# Altium schematic sheet S7CAS-PLEIADES-CARTE-MERE_P20_FPGA-Bank-0.SchDoc
size Tabloid; SheetNumber: 9; SheetTotal: 20; Sheet_Name: FPGA Bank 0; Size: 11x17
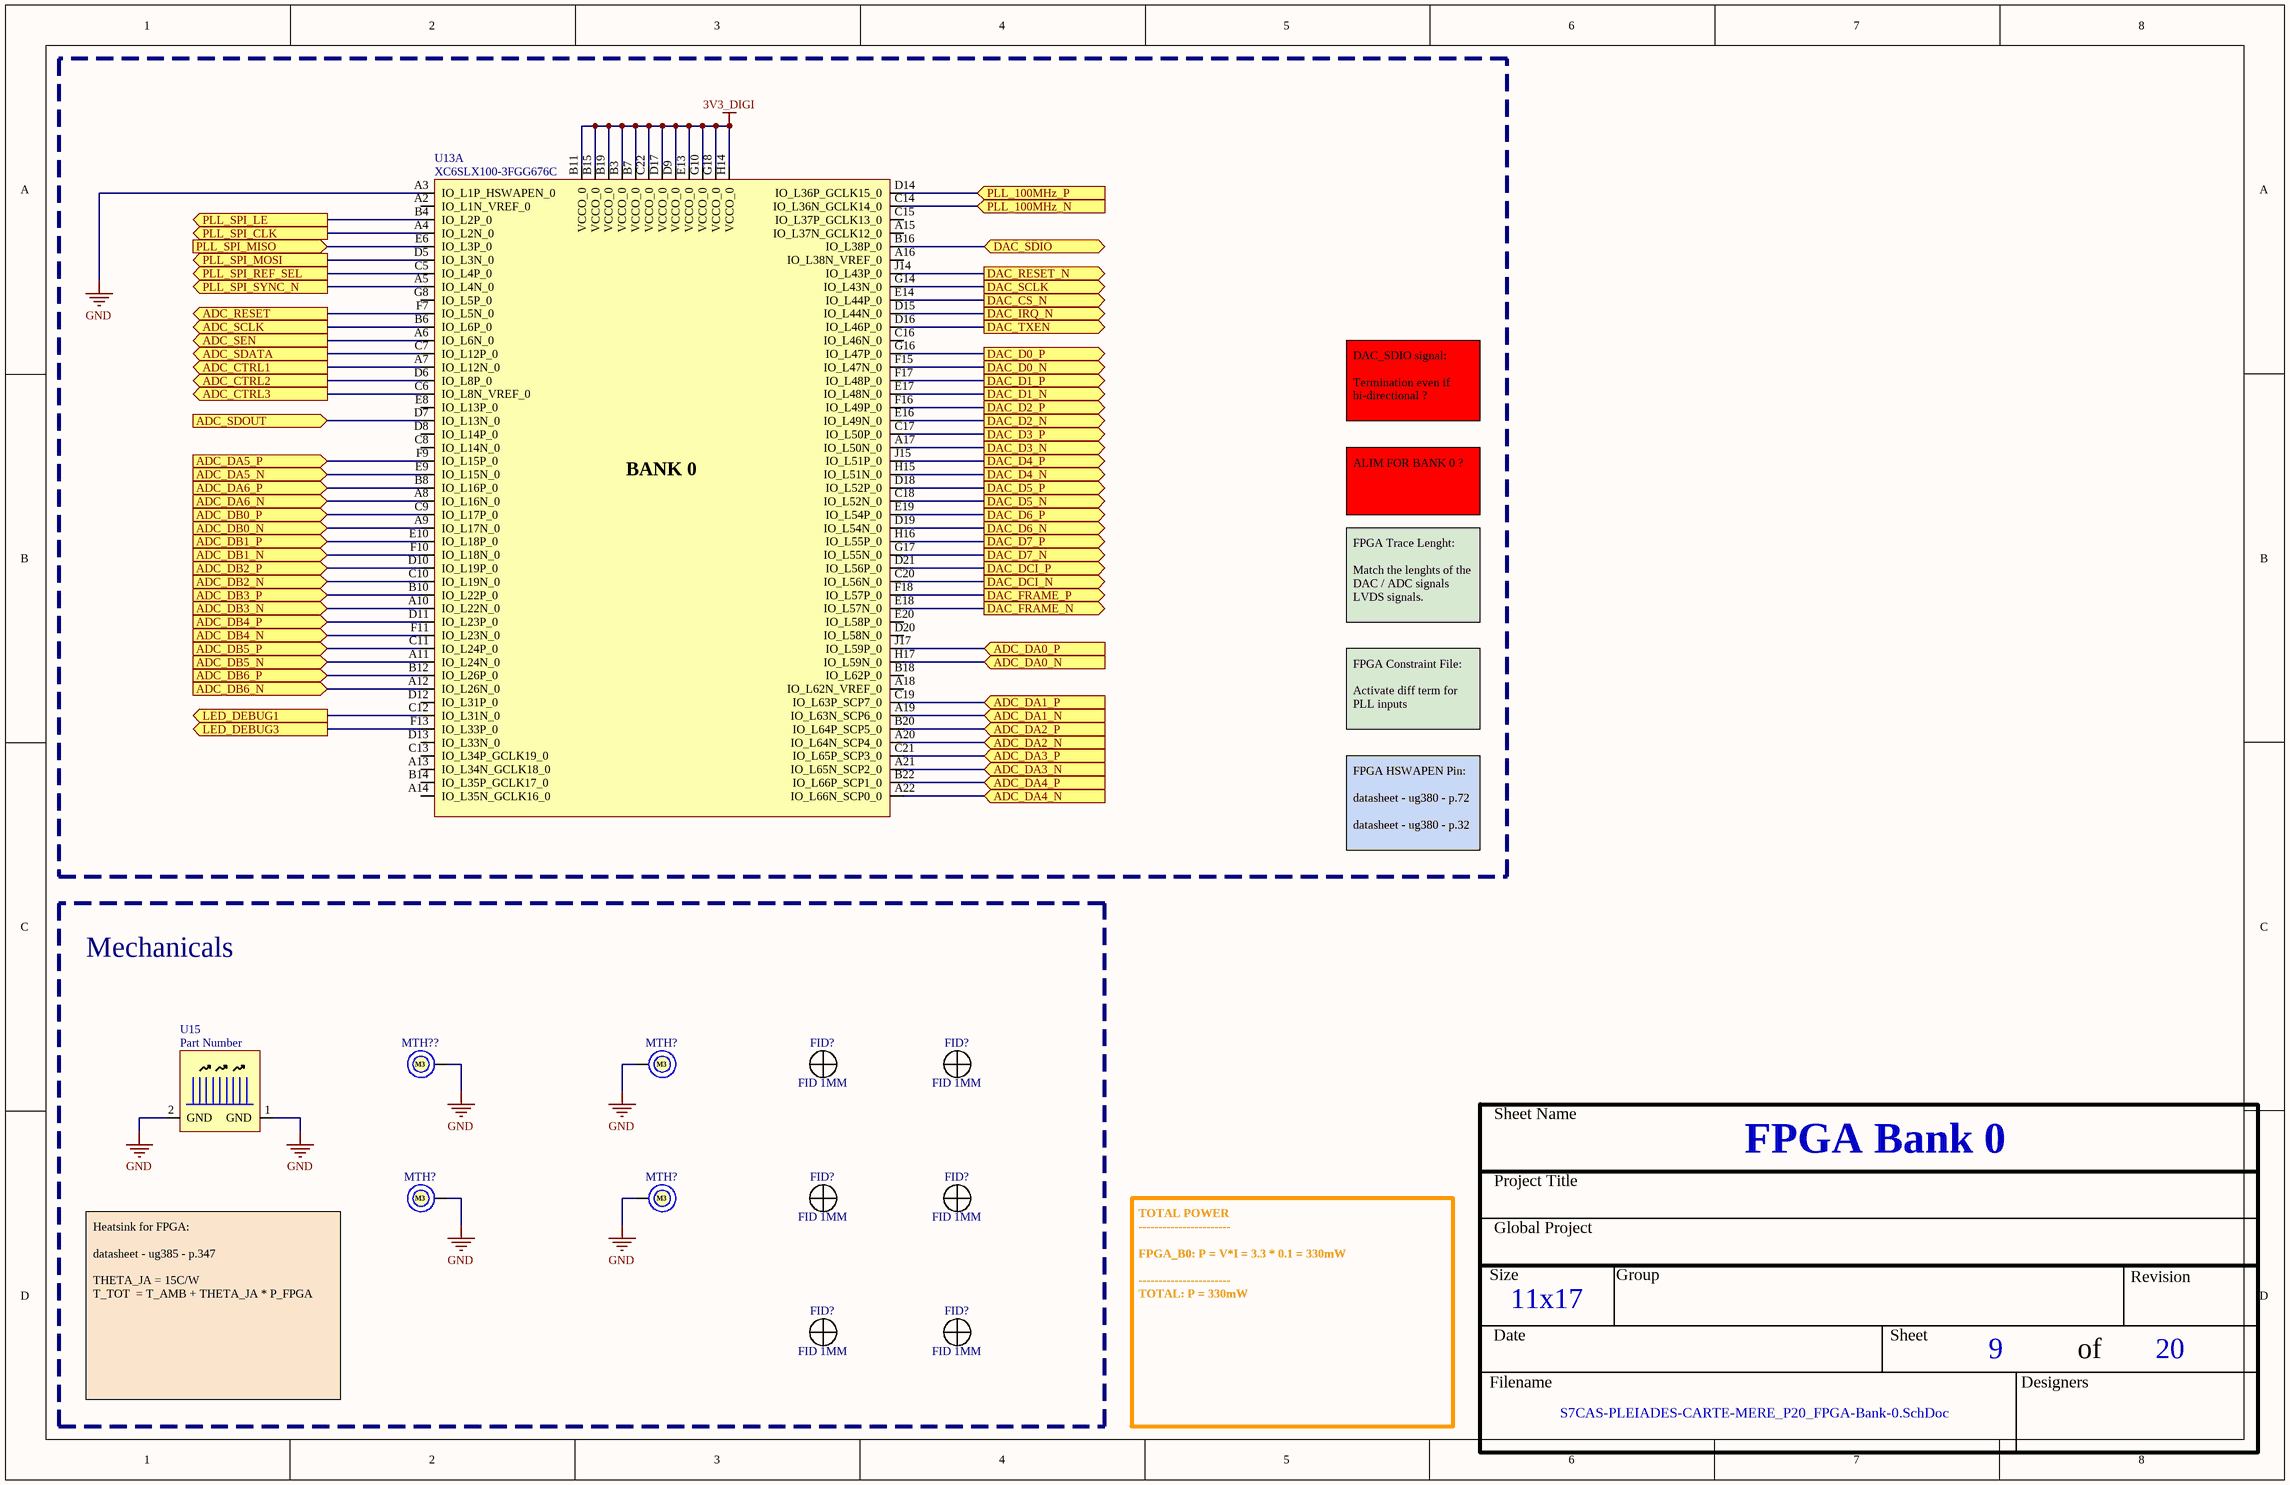
[diagram p0: S7CAS-PLEIADES-CARTE-MERE_P20_FPGA-Bank-0.SchDoc]

## Parts
(Parts that share a designator on the sheet are numbered #1, #2 ... from top to bottom, then left to right.)
FID?#1  FID 1MM  [FID_CIRCLE_1MM]
FID?#2  FID 1MM  [FID_CIRCLE_1MM]
FID?#3  FID 1MM  [FID_CIRCLE_1MM]
FID?#4  FID 1MM  [FID_CIRCLE_1MM]
FID?#5  FID 1MM  [FID_CIRCLE_1MM]
FID?#6  FID 1MM  [FID_CIRCLE_1MM]
MTH?#1  M3  [MTH_M3]  (no BOM)
MTH?#2  M3  [MTH_M3]  (no BOM)
MTH?#3  M3  [MTH_M3]  (no BOM)
MTH??  M3  [MTH_M3]  (no BOM)
U13  XC6SLX100-3FGG676C  [FPGA_XILINX_FGG676]  (part A of 10)
U15  Part Number

## Blocks framed on the sheet
Mechanicals: FID?#1-FID?#6 MTH?#1-MTH?#3 MTH?? U15

## Ports
ADC_CTRL1 (out), ADC_CTRL2 (out), ADC_CTRL3 (out), ADC_DA0_N (in), ADC_DA0_P (in), ADC_DA1_N (in), ADC_DA1_P (in), ADC_DA2_N (in), ADC_DA2_P (in), ADC_DA3_N (in), ADC_DA3_P (in), ADC_DA4_N (in), ADC_DA4_P (in), ADC_DA5_N (in), ADC_DA5_P (in), ADC_DA6_N (in), ADC_DA6_P (in), ADC_DB0_N (in), ADC_DB0_P (in), ADC_DB1_N (in), ADC_DB1_P (in), ADC_DB2_N (in), ADC_DB2_P (in), ADC_DB3_N (in), ADC_DB3_P (in), ADC_DB4_N (in), ADC_DB4_P (in), ADC_DB5_N (in), ADC_DB5_P (in), ADC_DB6_N (in), ADC_DB6_P (in), ADC_RESET (out), ADC_SCLK (out), ADC_SDATA (out), ADC_SDOUT (in), ADC_SEN (out), DAC_CS_N (out), DAC_D0_N (out), DAC_D0_P (out), DAC_D1_N (out), DAC_D1_P (out), DAC_D2_N (out), DAC_D2_P (out), DAC_D3_N (out), DAC_D3_P (out), DAC_D4_N (out), DAC_D4_P (out), DAC_D5_N (out), DAC_D5_P (out), DAC_D6_N (out), DAC_D6_P (out), DAC_D7_N (out), DAC_D7_P (out), DAC_DCI_N (out), DAC_DCI_P (out), DAC_FRAME_N (out), DAC_FRAME_P (out), DAC_IRQ_N (out), DAC_RESET_N (out), DAC_SCLK (out), DAC_SDIO (bidir), DAC_TXEN (out), LED_DEBUG1 (out), LED_DEBUG3 (out), PLL_100MHz_N (in), PLL_100MHz_P (in), PLL_SPI_CLK (out), PLL_SPI_LE (out), PLL_SPI_MISO (in), PLL_SPI_MOSI (out), PLL_SPI_REF_SEL (out), PLL_SPI_SYNC_N (out)

## Nets
3V3_DIGI: U13.B3(VCCO_0) U13.B7(VCCO_0) U13.B11(VCCO_0) U13.B15(VCCO_0) U13.B19(VCCO_0) U13.C22(VCCO_0) U13.D9(VCCO_0) U13.D17(VCCO_0) U13.E13(VCCO_0) U13.G10(VCCO_0) U13.G18(VCCO_0) U13.H14(VCCO_0)
GND: MTH?#1.1 MTH?#2.1 MTH?#3.1 MTH??.1 U13.A3(IO_L1P_HSWAPEN_0) U15.1(GND) U15.2(GND)
ADC_CTRL1: U13.A7(IO_L12N_0) ; port ADC_CTRL1
ADC_CTRL2: U13.D6(IO_L8P_0) ; port ADC_CTRL2
ADC_CTRL3: U13.C6(IO_L8N_VREF_0) ; port ADC_CTRL3
ADC_DA0_N: U13.H17(IO_L59N_0) ; port ADC_DA0_N
ADC_DA0_P: U13.J17(IO_L59P_0) ; port ADC_DA0_P
ADC_DA1_N: U13.A19(IO_L63N_SCP6_0) ; port ADC_DA1_N
ADC_DA1_P: U13.C19(IO_L63P_SCP7_0) ; port ADC_DA1_P
ADC_DA2_N: U13.A20(IO_L64N_SCP4_0) ; port ADC_DA2_N
ADC_DA2_P: U13.B20(IO_L64P_SCP5_0) ; port ADC_DA2_P
ADC_DA3_N: U13.A21(IO_L65N_SCP2_0) ; port ADC_DA3_N
ADC_DA3_P: U13.C21(IO_L65P_SCP3_0) ; port ADC_DA3_P
ADC_DA4_N: U13.A22(IO_L66N_SCP0_0) ; port ADC_DA4_N
ADC_DA4_P: U13.B22(IO_L66P_SCP1_0) ; port ADC_DA4_P
ADC_DA5_N: U13.E9(IO_L15N_0) ; port ADC_DA5_N
ADC_DA5_P: U13.F9(IO_L15P_0) ; port ADC_DA5_P
ADC_DA6_N: U13.A8(IO_L16N_0) ; port ADC_DA6_N
ADC_DA6_P: U13.B8(IO_L16P_0) ; port ADC_DA6_P
ADC_DB0_N: U13.A9(IO_L17N_0) ; port ADC_DB0_N
ADC_DB0_P: U13.C9(IO_L17P_0) ; port ADC_DB0_P
ADC_DB1_N: U13.F10(IO_L18N_0) ; port ADC_DB1_N
ADC_DB1_P: U13.E10(IO_L18P_0) ; port ADC_DB1_P
ADC_DB2_N: U13.C10(IO_L19N_0) ; port ADC_DB2_N
ADC_DB2_P: U13.D10(IO_L19P_0) ; port ADC_DB2_P
ADC_DB3_N: U13.A10(IO_L22N_0) ; port ADC_DB3_N
ADC_DB3_P: U13.B10(IO_L22P_0) ; port ADC_DB3_P
ADC_DB4_N: U13.F11(IO_L23N_0) ; port ADC_DB4_N
ADC_DB4_P: U13.D11(IO_L23P_0) ; port ADC_DB4_P
ADC_DB5_N: U13.A11(IO_L24N_0) ; port ADC_DB5_N
ADC_DB5_P: U13.C11(IO_L24P_0) ; port ADC_DB5_P
ADC_DB6_N: U13.A12(IO_L26N_0) ; port ADC_DB6_N
ADC_DB6_P: U13.B12(IO_L26P_0) ; port ADC_DB6_P
ADC_RESET: U13.F7(IO_L5N_0) ; port ADC_RESET
ADC_SCLK: U13.B6(IO_L6P_0) ; port ADC_SCLK
ADC_SDATA: U13.C7(IO_L12P_0) ; port ADC_SDATA
ADC_SDOUT: U13.D7(IO_L13N_0) ; port ADC_SDOUT
ADC_SEN: U13.A6(IO_L6N_0) ; port ADC_SEN
DAC_CS_N: U13.E14(IO_L44P_0) ; port DAC_CS_N
DAC_D0_N: U13.F15(IO_L47N_0) ; port DAC_D0_N
DAC_D0_P: U13.G16(IO_L47P_0) ; port DAC_D0_P
DAC_D1_N: U13.E17(IO_L48N_0) ; port DAC_D1_N
DAC_D1_P: U13.F17(IO_L48P_0) ; port DAC_D1_P
DAC_D2_N: U13.E16(IO_L49N_0) ; port DAC_D2_N
DAC_D2_P: U13.F16(IO_L49P_0) ; port DAC_D2_P
DAC_D3_N: U13.A17(IO_L50N_0) ; port DAC_D3_N
DAC_D3_P: U13.C17(IO_L50P_0) ; port DAC_D3_P
DAC_D4_N: U13.H15(IO_L51N_0) ; port DAC_D4_N
DAC_D4_P: U13.J15(IO_L51P_0) ; port DAC_D4_P
DAC_D5_N: U13.C18(IO_L52N_0) ; port DAC_D5_N
DAC_D5_P: U13.D18(IO_L52P_0) ; port DAC_D5_P
DAC_D6_N: U13.D19(IO_L54N_0) ; port DAC_D6_N
DAC_D6_P: U13.E19(IO_L54P_0) ; port DAC_D6_P
DAC_D7_N: U13.G17(IO_L55N_0) ; port DAC_D7_N
DAC_D7_P: U13.H16(IO_L55P_0) ; port DAC_D7_P
DAC_DCI_N: U13.C20(IO_L56N_0) ; port DAC_DCI_N
DAC_DCI_P: U13.D21(IO_L56P_0) ; port DAC_DCI_P
DAC_FRAME_N: U13.E18(IO_L57N_0) ; port DAC_FRAME_N
DAC_FRAME_P: U13.F18(IO_L57P_0) ; port DAC_FRAME_P
DAC_IRQ_N: U13.D15(IO_L44N_0) ; port DAC_IRQ_N
DAC_RESET_N: U13.J14(IO_L43P_0) ; port DAC_RESET_N
DAC_SCLK: U13.G14(IO_L43N_0) ; port DAC_SCLK
DAC_SDIO: U13.B16(IO_L38P_0) ; port DAC_SDIO
DAC_TXEN: U13.D16(IO_L46P_0) ; port DAC_TXEN
LED_DEBUG1: U13.C12(IO_L31N_0) ; port LED_DEBUG1
LED_DEBUG3: U13.F13(IO_L33P_0) ; port LED_DEBUG3
PLL_100MHz_N: U13.C14(IO_L36N_GCLK14_0) ; port PLL_100MHz_N
PLL_100MHz_P: U13.D14(IO_L36P_GCLK15_0) ; port PLL_100MHz_P
PLL_SPI_CLK: U13.A4(IO_L2N_0) ; port PLL_SPI_CLK
PLL_SPI_LE: U13.B4(IO_L2P_0) ; port PLL_SPI_LE
PLL_SPI_MISO: U13.E6(IO_L3P_0) ; port PLL_SPI_MISO
PLL_SPI_MOSI: U13.D5(IO_L3N_0) ; port PLL_SPI_MOSI
PLL_SPI_REF_SEL: U13.C5(IO_L4P_0) ; port PLL_SPI_REF_SEL
PLL_SPI_SYNC_N: U13.A5(IO_L4N_0) ; port PLL_SPI_SYNC_N

Not connected (* = marked no-connect by the designer): FID?#1 1 2; FID?#2 1 2; FID?#3 1 2; FID?#4 1 2; FID?#5 1 2; FID?#6 1 2; U13 A2(IO_L1N_VREF_0) A13(IO_L34N_GCLK18_0) A14(IO_L35N_GCLK16_0) A15(IO_L37N_GCLK12_0) A16(IO_L38N_VREF_0) A18(IO_L62N_VREF_0) B14(IO_L35P_GCLK17_0) B18(IO_L62P_0) C8(IO_L14N_0) C13(IO_L34P_GCLK19_0) C15(IO_L37P_GCLK13_0) C16(IO_L46N_0) D8(IO_L14P_0) D12(IO_L31P_0) D13(IO_L33N_0) D20(IO_L58N_0) E8(IO_L13P_0) E20(IO_L58P_0) G8(IO_L5P_0)

## Notes on the sheet
- DAC_SDIO signal:
  Termination even if bi-directional ?
- ALIM FOR BANK 0 ?
- FPGA Trace Lenght:
  Match the lenghts of the DAC / ADC signals LVDS signals.
- FPGA Constraint File:
  Activate diff term for PLL inputs
- FPGA HSWAPEN Pin:
  datasheet - ug380 - p.72
  datasheet - ug380 - p.32
- Heatsink for FPGA:
  datasheet - ug385 - p.347
  THETA_JA = 15C/W
  T_TOT  = T_AMB + THETA_JA * P_FPGA
- TOTAL POWER
  -----------------------
  FPGA_B0: P = V*I = 3.3 * 0.1 = 330mW
  -----------------------
  TOTAL: P = 330mW
- Sheet Name
- Project Title
- Global Project
- Size
- Group
- Revision
- Date
- Sheet
- of
- Filename
- Designers
- (in symbol FPGA_XC6SLX100-3FGG676C, part A) BANK 0

## Library data of the parts
FID?#1-FID?#6 = FID_CIRCLE_1MM: FID - FIDUCIAL 1MM CIRCLE DOUBLE-SIDED - 1MM; GRAMS Lib Spec: 2.8; Magnetic Material: NO; Cryo: UNKNOWN; Value: *; Tolerance: *; Voltage Rating: *; Current Rating: *; Power Max: *; HelpURL: https://www.pcb-3d.com/wordpress/wp-content/uploads/ipc-sm-782a_amendment_1_and_2.pdf; CreatedBy/Date: Jonathan Bouchard 2018-07-23; VerifiedBy: Caroline Paulin - 25 juillet 2018; Temperature: *; Package: 1MM CIRCLE; Manufacturer #1: *; Manufacturer #2: *; Note: *; Assembly Type: NONE; Part Number #2: *; Part Number #1: *; Polarized: *; Supplier 1: *; Supplier Part Number 1: *
MTH?#1-MTH?#3 MTH?? = MTH_M3: MTH - MOUNTING HOLE M3 PLATED - M3; GRAMS Lib Spec: 2.8; Magnetic Material: NO; Cryo: UNKNOWN; Value: *; Tolerance: *; Voltage Rating: *; Current Rating: *; Power Max: *; HelpURL: https://littlemachineshop.com/images/gallery/PDF/TapDrillSizes.pdf; CreatedBy/Date: Jonathan Bouchard 2018-07-23; VerifiedBy: Arnaud Samson 23-07-18; Temperature: *; Package: M3; Manufacturer #1: *; Manufacturer #2: *; Note: *; Assembly Type: NONE; Part Number #2: *; Part Number #1: *; Polarized: *; Supplier 1: *; Supplier Part Number 1: *
U13 = FPGA_XC6SLX100-3FGG676C: FPGA - XILINX SPARTAN 6 480 I/O - BGA-676; Voltage: 1.14 V ~ 1.26 V; Current: *; Power: *; Mfg: Xilinx; Mfg Part Number: XC6SLX100-3FGG676C; HelpURL: https://www.xilinx.com/support/documentation/data_sheets/ds162.pdf; CreatedBy: Jonathan Bouchard; Temperature: 0°C ~ 85°C (TJ); Value: *; Precision: *; Package: BGA-676; Supplier 1: Digikey; Supplier Part Number 1: 122-1760-ND
U15 = HEATSINK: XXX - Description - Package; GRAMS Lib Spec: 2.7